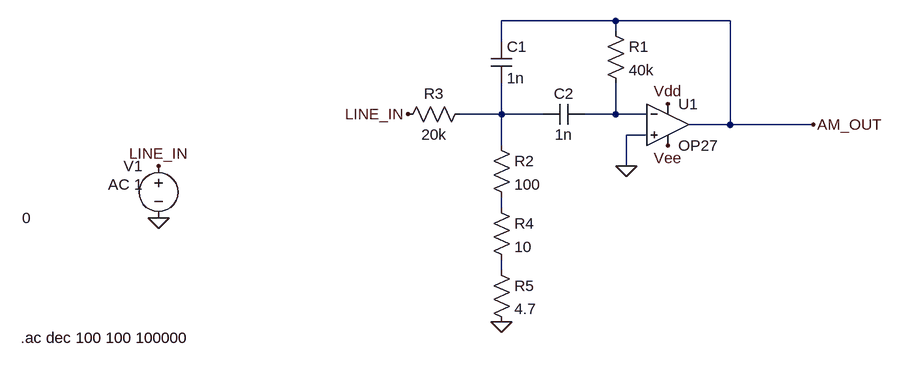
[diagram p0: schematic Draft3.asc]
Draft3.asc, the LTspice schematic file:
Version 4
SHEET 1 880 680
WIRE -32 -16 -208 -16
WIRE 144 -16 -32 -16
WIRE -32 0 -32 -16
WIRE -208 16 -208 -16
WIRE -208 128 -208 80
WIRE -208 128 -272 128
WIRE -144 128 -208 128
WIRE -32 128 -32 80
WIRE -32 128 -80 128
WIRE 16 128 -32 128
WIRE 144 144 144 -16
WIRE 144 144 80 144
WIRE 272 144 144 144
WIRE 16 160 -16 160
WIRE -208 176 -208 128
WIRE -16 208 -16 160
WIRE -208 272 -208 256
WIRE -208 368 -208 352
FLAG -16 208 0
FLAG 48 112 Vdd
FLAG 48 176 Vee
FLAG -208 448 0
FLAG 272 144 AM_OUT
FLAG -736 288 0
FLAG -736 208 LINE_IN
FLAG -352 128 LINE_IN
SYMBOL Opamps\\OP27 48 80 R0
SYMATTR InstName U1
SYMBOL res -48 -16 R0
SYMATTR InstName R1
SYMATTR Value 40k
SYMBOL cap -224 16 R0
SYMATTR InstName C1
SYMATTR Value 1n
SYMBOL res -224 160 R0
SYMATTR InstName R2
SYMATTR Value 100
SYMBOL res -256 112 R90
WINDOW 0 0 56 VBottom 2
WINDOW 3 32 56 VTop 2
SYMATTR InstName R3
SYMATTR Value 20k
SYMBOL cap -80 112 R90
WINDOW 0 0 32 VBottom 2
WINDOW 3 32 32 VTop 2
SYMATTR InstName C2
SYMATTR Value 1n
SYMBOL res -224 256 R0
SYMATTR InstName R4
SYMATTR Value 10
SYMBOL res -224 352 R0
SYMATTR InstName R5
SYMATTR Value 4.7
SYMBOL voltage -736 192 M0
WINDOW 3 210 96 Right 2
WINDOW 123 24 44 Left 2
WINDOW 39 0 0 Left 0
SYMATTR Value 0
SYMATTR Value2 AC 1
SYMATTR InstName V1
TEXT -948 472 Left 2 !.ac dec 100 100 100000

The netlist it stands for:
* Draft3.asc
XU1 0 N002 Vdd Vee AM_OUT OP27  ; pins In+ In- V+ V- OUT
R1 AM_OUT N002 40k
C1 AM_OUT N001 1n
R2 N001 N003 100
R3 N001 LINE_IN 20k
C2 N002 N001 1n
R4 N003 N004 10
R5 N004 0 4.7
V1 LINE_IN 0 0 AC 1
.ac dec 100 100 100000
.lib ADI.lib
.backanno
.end